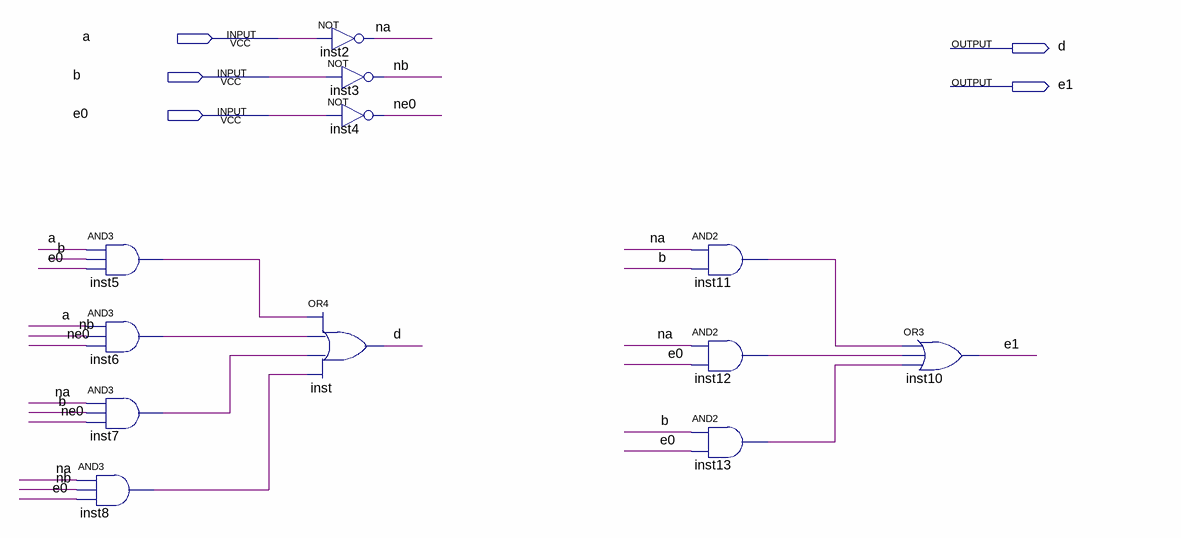
[diagram p0: schematic sheet]
// Quartus schematic sub1.bdf as structural Verilog: 12 symbols, 5 pins
module sub1 (
  input  a,
  input  b,
  input  e0,
  output d,
  output e1
);

  wire inst5_out, inst6_out, inst7_out, inst8_out, inst11_out, inst12_out, inst13_out, na, nb, ne0;

  and inst5 (inst5_out, a, b, e0);
  and inst6 (inst6_out, a, nb, ne0);
  and inst7 (inst7_out, na, b, ne0);
  and inst8 (inst8_out, na, nb, e0);
  not inst2 (na, a);
  not inst3 (nb, b);
  not inst4 (ne0, e0);
  or inst (d, inst5_out, inst6_out, inst7_out, inst8_out);
  and inst11 (inst11_out, na, b);
  and inst12 (inst12_out, na, e0);
  and inst13 (inst13_out, b, e0);
  or inst10 (e1, inst11_out, inst12_out, inst13_out);
endmodule
